# EAGLE design drillholes (EAGLE 7.6.0)

## Sheet 1 of 2
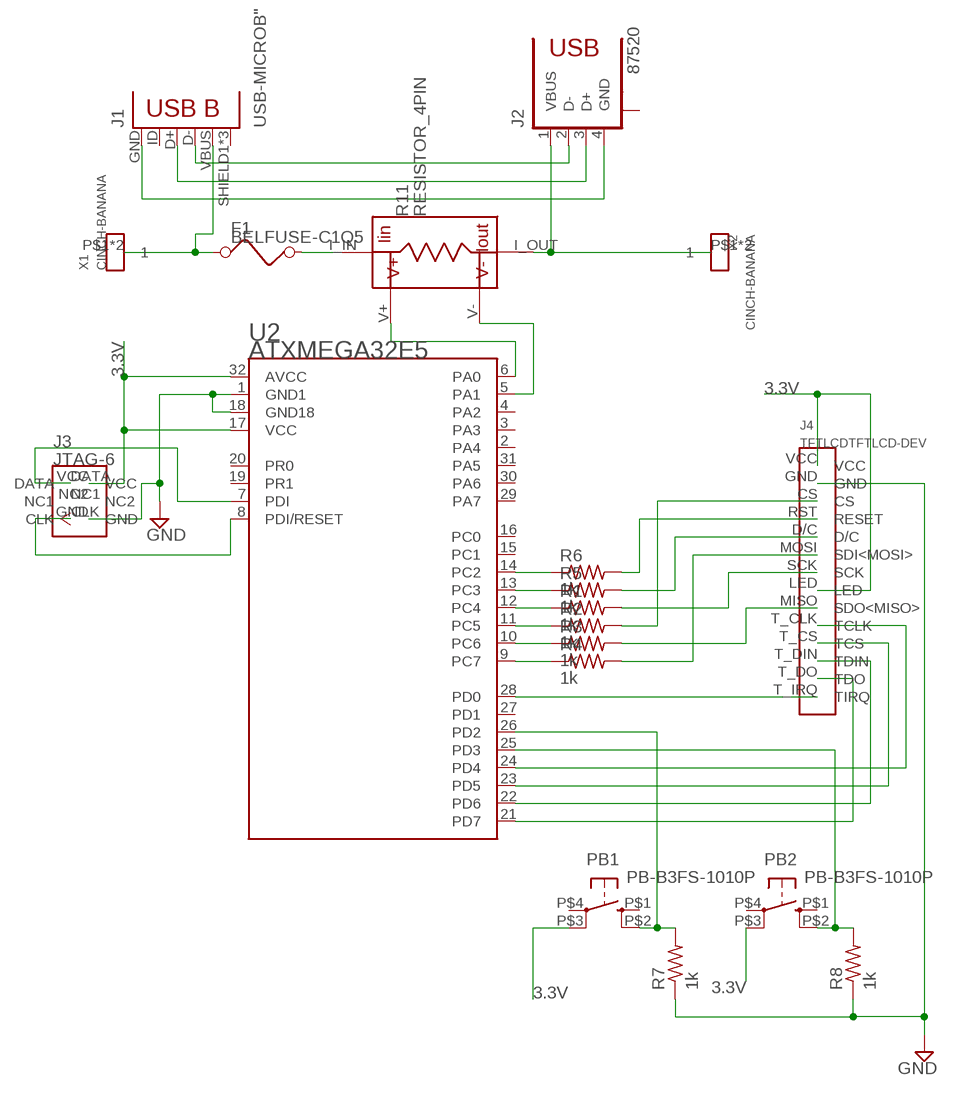
[diagram p0: schematic, sheet 1]

### Parts
ATXMEGA32E5  U2  ATXMEGA32E5/16E5/8E5ATXMEGA32E5-AU  [TQFP32-08]
F1  BELFUSE-C1Q5  [BELFUSE-C1Q5]
J1  USB-MICROB"  [USB-B-MICRO-SMD_V03]
J2  87520  [87520]
J3  JTAG-6  [JTAG6]
J4  TFTLCDTFTLCD-DEV  [TFTLCD]
PB1  PB-B3FS-1010P  [PB-B3FS-1010P]
PB2  PB-B3FS-1010P  [PB-B3FS-1010P]
R1  1k  R-RC1206  [RC1206]
R2  1k  R-RC1206  [RC1206]
R3  1k  R-RC1206  [RC1206]
R4  1k  R-RC1206  [RC1206]
R5  1k  R-RC1206  [RC1206]
R6  1k  R-RC1206  [RC1206]
R7  1k  R-RC1206  [RC1206]
R8  1k  R-RC1206  [RC1206]
R11  RESISTOR_4PIN  [RESISTOR_4PIN]
X1  CINCH-BANANA  [CINCH-BANANA]
X2  CINCH-BANANA  [CINCH-BANANA]

### Nets
3.3V: ATXMEGA32E5.17(VCC) ATXMEGA32E5.32(AVCC) J3.VCC J4.LED J4.VCC PB1.P$3(SW3) PB2.P$3(SW3) ; also sheet 2
GND: ATXMEGA32E5.1(GND1) ATXMEGA32E5.18(GND18) J3.GND J4.GND R7.P$1 R8.P$1 ; also sheet 2
N$1: ATXMEGA32E5.7(PDI) J3.DATA
N$2: ATXMEGA32E5.8(PDI/RESET) J3.CLK
N$3: ATXMEGA32E5.9(PC7) R4.P$1
N$4: ATXMEGA32E5.10(PC6) R3.P$1
N$5: ATXMEGA32E5.11(PC5) R2.P$1
N$6: ATXMEGA32E5.12(PC4) R1.P$1
N$7: J4.MOSI(SDI<MOSI>) R4.P$2
N$8: J4.MISO(SDO<MISO>) R3.P$2
N$9: J4.SCK R1.P$2
N$10: J4.CS R2.P$2
N$11: ATXMEGA32E5.14(PC2) R6.P$1
N$12: J4.RST(RESET) R6.P$2
N$13: ATXMEGA32E5.13(PC3) R5.P$1
N$14: J4.D/C R5.P$2
N$15: ATXMEGA32E5.28(PD0) J4.T_IRQ(TIRQ)
N$16: ATXMEGA32E5.21(PD7) J4.T_DO(TDO)
N$17: ATXMEGA32E5.22(PD6) J4.T_DIN(TDIN)
N$18: ATXMEGA32E5.23(PD5) J4.T_CS(TCS)
N$19: ATXMEGA32E5.24(PD4) J4.T_CLK(TCLK)
N$20: ATXMEGA32E5.26(PD2) PB1.P$2(SW2) R7.P$2
N$21: ATXMEGA32E5.25(PD3) PB2.P$2(SW2) R8.P$2
N$22: ATXMEGA32E5.6(PA0) R11.V+
N$23: ATXMEGA32E5.5(PA1) R11.V-
N$24: F1.P$1 J1.VBUS X1.P$1 X1.P$2
N$25: F1.P$2 R11.I_IN
N$26: J1.GND J2.4(GND)
N$28: J1.D+ J2.3(D+)
N$29: J1.D- J2.2(D-)
N$30: J2.1(VBUS) R11.I_OUT X2.P$1 X2.P$2
Unconnected: ATXMEGA32E5.2(PA4) ATXMEGA32E5.3(PA3) ATXMEGA32E5.4(PA2) ATXMEGA32E5.15(PC1) ATXMEGA32E5.16(PC0) ATXMEGA32E5.19(PR1) ATXMEGA32E5.20(PR0) ATXMEGA32E5.27(PD1) ATXMEGA32E5.29(PA7) ATXMEGA32E5.30(PA6) ATXMEGA32E5.31(PA5) J1.ID(USBID) J1.SHIELD1(SHIELD) J1.SHIELD2(SHIELD) J1.SHIELD3(SHIELD) J2.S1 J2.S2 J3.NC1 J3.NC2 PB1.P$1(SW1) PB1.P$4(SW4) PB2.P$1(SW1) PB2.P$4(SW4)

## Sheet 2 of 2
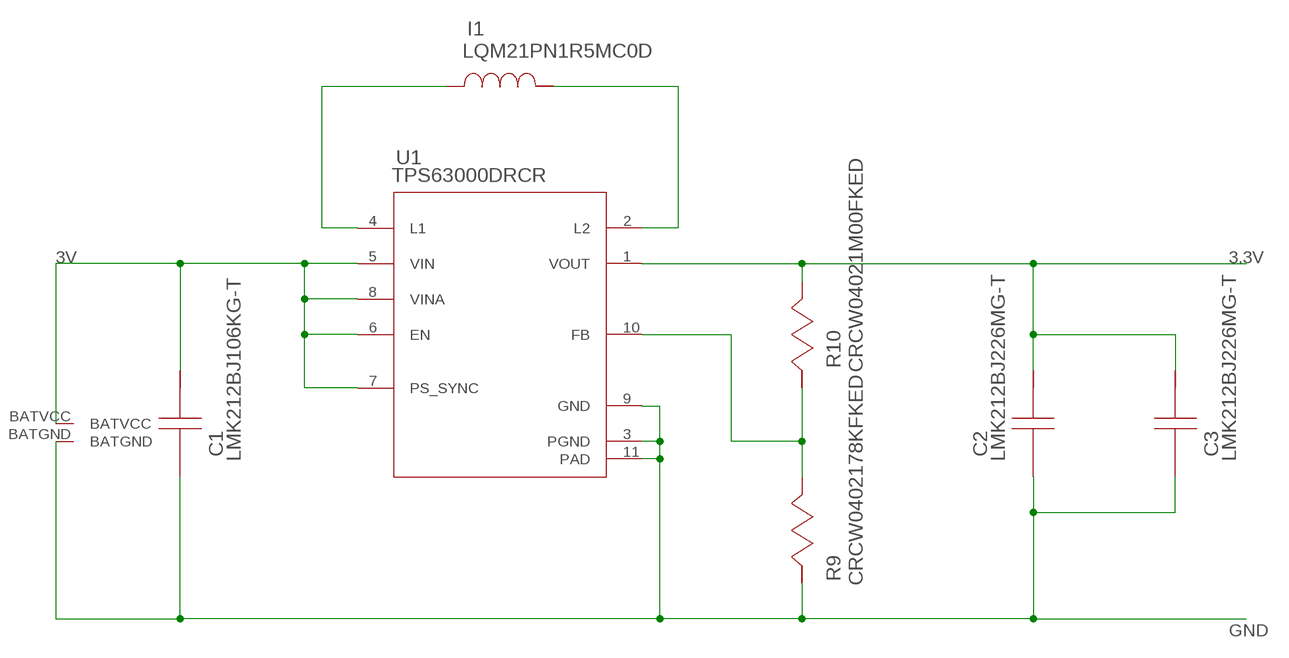
[diagram p1: schematic, sheet 2]

### Parts
C1  LMK212BJ106KG-T  [0805]
C2  LMK212BJ226MG-T  [0805]
C3  LMK212BJ226MG-T  [0805]
I1  LQM21PN1R5MC0D  [0805]
R9  CRCW0402178KFKED  [0402]
R10  CRCW04021M00FKED  [0402]
U1  TPS63000DRCR  [DRC0010J]
U$12  BATTERYHOLDER  [BATTERYHOLDER]

### Nets
3.3V: C2.1 C3.1 R10.1 U1.1(VOUT) ; also sheet 1
3V: C1.1 U1.5(VIN) U1.6(EN) U1.7(PS_SYNC) U1.8(VINA) U$12.BATVCC
GND: C1.2 C2.2 C3.2 R9.2 U1.3(PGND) U1.9(GND) U1.11(PAD) U$12.BATGND ; also sheet 1
N$31: I1.1 U1.4(L1)
N$32: I1.2 U1.2(L2)
N$34: R9.1 R10.2 U1.10(FB)

## Library data of the parts
ATXMEGA32E5 = ese323:ATXMEGA32E5/16E5/8E5: 8/16-bit Atmel AVR XMEGA Microcontrollers
C1 = 00ese323:LMK212BJ106KG-T; MANUFACTURER_NAME: Taiyo Yuden; VENDOR: Taiyo Yuden
C2 C3 = 00ese323:LMK212BJ226MG-T; MANUFACTURER_NAME: Taiyo Yuden; VENDOR: Taiyo Yuden
F1 = 00ese323:BELFUSE-C1Q5
I1 = 00ese323:LQM21PN1R5MC0D; MANUFACTURER_NAME: MuRata; VENDOR: MuRata
J1 = 00ese323:USB-MICROB; PROD_ID: CONN-11752
J2 = 00ese323:87520: TYPE-A Receptacle, FCI
J3 = 00ese323:JTAG-6
J4 = 00ese323:TFTLCD
PB1 PB2 = 00ese323:PB-B3FS-1010P
R1-R8 = 00ese323:R-RC1206
R9 = 00ese323:CRCW0402178KFKED; MANUFACTURER_NAME: Vishay-Dale; VENDOR: Vishay-Dale
R10 = 00ese323:CRCW04021M00FKED; MANUFACTURER_NAME: Vishay-Dale; VENDOR: Vishay-Dale
R11 = 00ese323:RESISTOR_4PIN
U1 = 00ese323:TPS63000DRCR; MANUFACTURER_NAME: Texas Instruments; MANUFACTURER_PART_NUMBER: TPS63000DRCR
U$12 = 00ese323:BATTERYHOLDER
X1 X2 = 00ese323:CINCH-BANANA

## Board
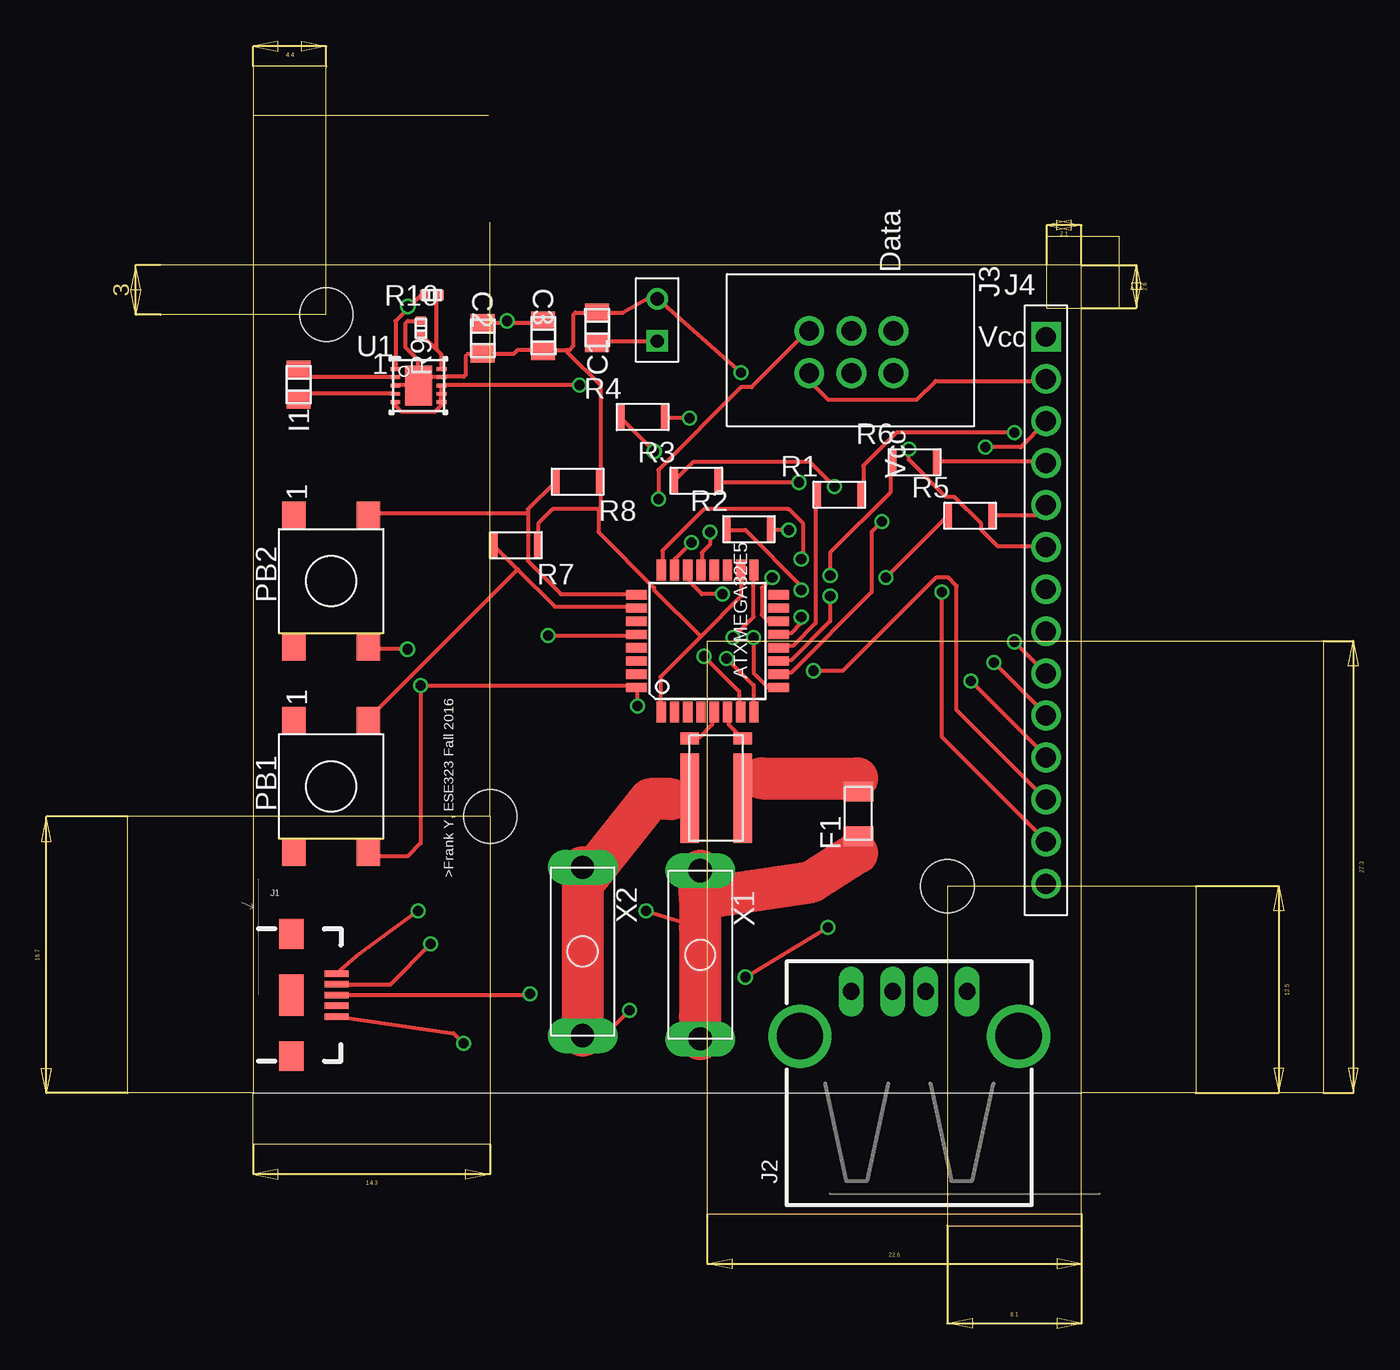
[diagram p2: board, top side]
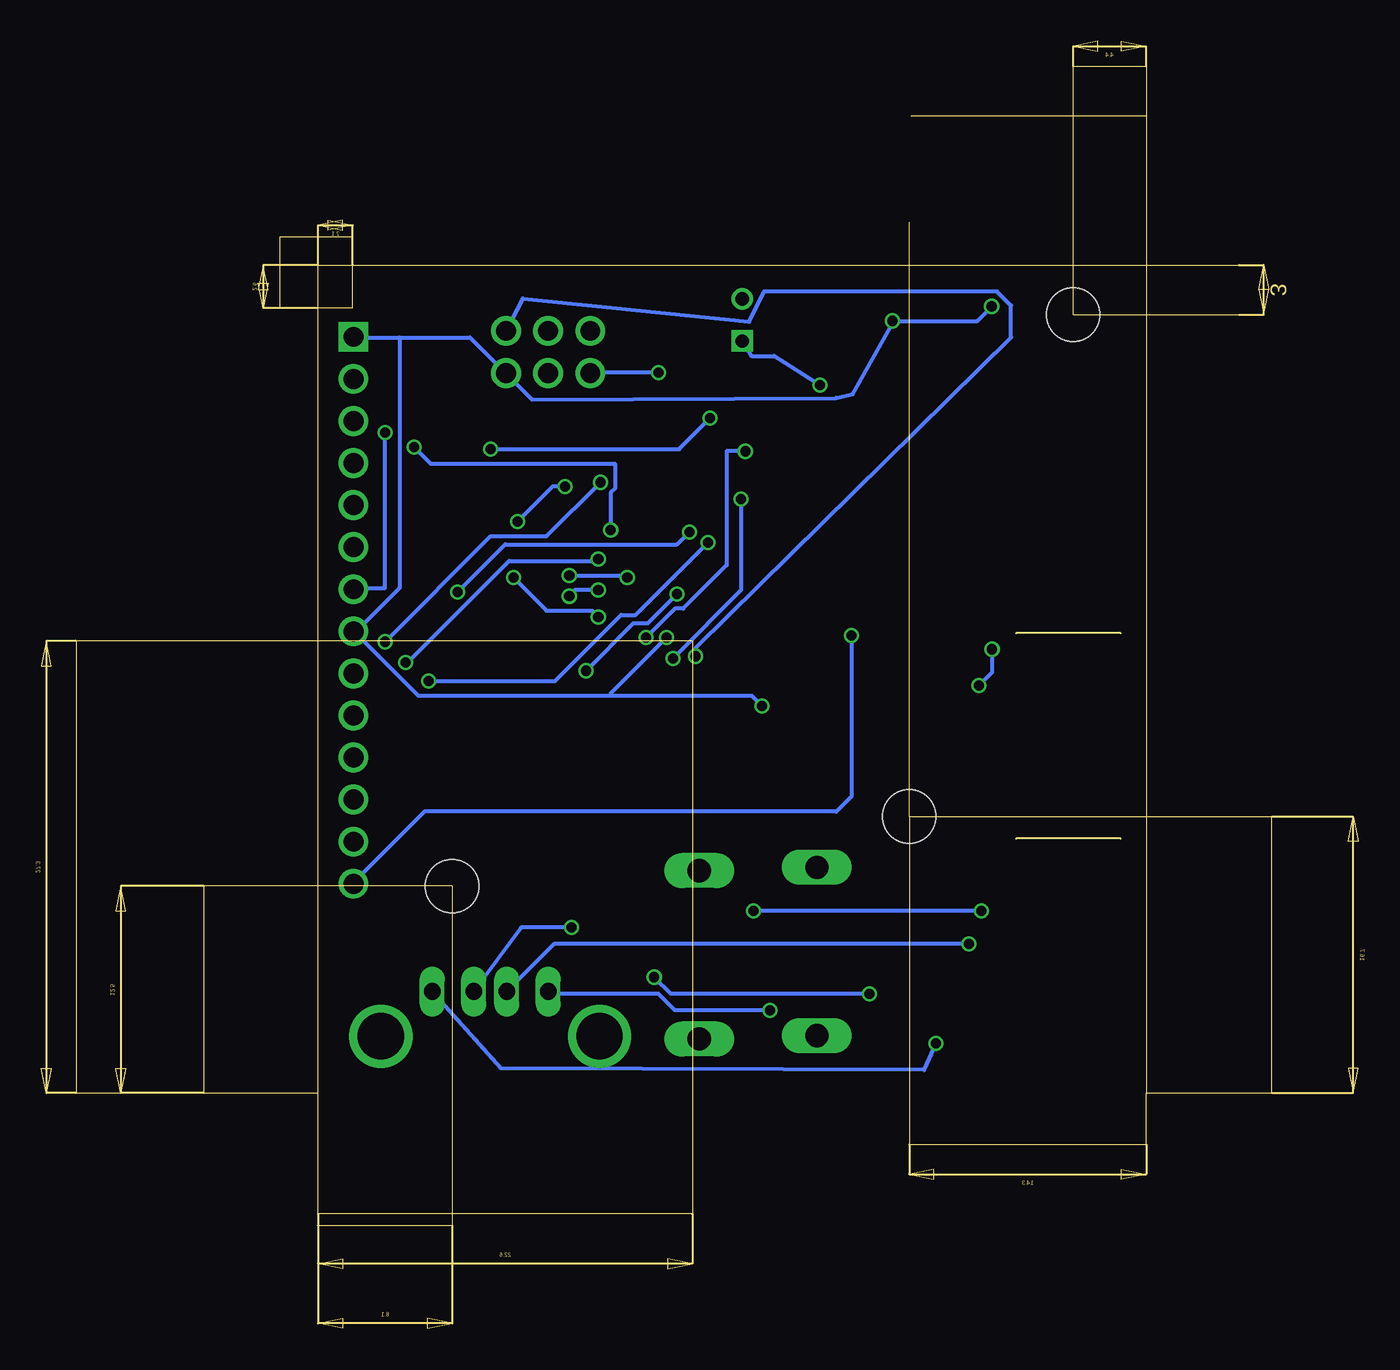
[diagram p3: board, bottom side, seen from below]

Size 72.2 x 70 mm. Coordinates in mm from the lower left corner, seen from the top.
Outline: 57.6,8 57.6,58
Outline: 57.6,58 7.6,58
Outline: 7.6,58 7.6,8
Outline: 7.6,58 2,58
Outline: 2,55 12,55 12,70 7.6,70 7.6,67
Outline: 21.9,24.7 0,24.7 0,8 7.6,8
Outline: 21.8,67 7.6,67
Outline: 7.6,67 7.6,58
Outline: 64.5,8 64.5,20.5 49.5,20.5 49.5,0 57.6,0 57.6,0.7
Outline: 64.5,8 57.6,8
Outline: 57.6,0.7 57.6,8
Outline: 21.9,24.7 21.9,60.6
Outline: 21.9,24.7 21.9,4.9 7.6,4.9 7.6,8
Outline: 64.5,8 72.2,8 72.2,35.3 35,35.3 35,0.7 57.6,0.7
Outline: 57.6,59.7 59.9,59.7 59.9,55.4 55.5,55.4 55.5,59.7 57.6,59.7
Outline: 57.6,58 57.6,59.7
Outline: 57.6,58 60,58
Copper layers (1*16): Top 0.035mm / dielectric 1.5mm / Bottom 0.035mm
Design rules "SeeedStudio_2layer_DRU_no_angle_20140221": minimum track width 6mil, minimum drill 12mil, track to track 6mil, track to pad 6mil, pad to pad 6mil, via to via 6mil, smd to smd 0mil, copper to edge 10mil, drill to drill 10mil, minimum pad ring 10mil, minimum via ring 6mil, stop-mask expansion 2mil, vias tented up to drill 100mil, thermal gap 10mil
Holes 3.2 mm at 12,55 49.5,20.5 21.9,24.7

### Footprints (pad centres in the part's own frame; a part is rotated, then mirrored left to right if it is on the bottom)
TQFP32-08 = smd 1.27 x 0.559: 1 -4.293,2.8; 2 -4.293,2; 3 -4.293,1.2; 4 -4.293,0.4; 5 -4.293,-0.4; 6 -4.293,-1.2; 7 -4.293,-2; 8 -4.293,-2.8; 17 4.293,-2.8; 18 4.293,-2; 19 4.293,-1.2; 20 4.293,-0.4; 21 4.293,0.4; 22 4.293,1.2; 23 4.293,2; 24 4.293,2.8 | smd 0.559 x 1.27: 9 -2.8,-4.293; 10 -2,-4.293; 11 -1.2,-4.293; 12 -0.4,-4.293; 13 0.4,-4.293; 14 1.2,-4.293; 15 2,-4.293; 16 2.8,-4.293; 25 2.8,4.293; 26 2,4.293; 27 1.2,4.293; 28 0.4,4.293; 29 -0.4,4.293; 30 -1.2,4.293; 31 -2,4.293; 32 -2.8,4.293
0805 = smd 1.118 x 1.448: 1 -0.902,0; 2 0.902,0
BELFUSE-C1Q5 = smd 1.2 x 1.8: P$1 0.2,-0.8; P$2 2.9,-0.8
USB-B-MICRO-SMD_V03 = smd 1.45 x 0.4: D+ 2.725,0; D- 2.725,0.65; GND 2.725,-1.3; ID 2.725,-0.65; VBUS 2.725,1.3 | smd 1.5 x 1.8: SHIELD1 0,3.685; SHIELD2 0,-3.685 | smd 1.5 x 2.5: SHIELD3 0,0
87520 = drill 1 long: 1 -3.5,2.71; 2 -1,2.71; 3 1,2.71; 4 3.5,2.71 | drill 2.8: S1 -6.6,0; S2 6.6,0
JTAG6 = drill 1.2: CLK -1.27,-6.14; DATA -1.27,-1.06; GND 1.27,-6.14; NC1 -1.27,-3.6; NC2 1.27,-3.6; VCC 1.27,-1.06
TFTLCD = drill 1.2: CS 0,7.62; D/C 0,2.54; GND 0,10.16; LED 0,-5.08; MISO 0,-7.62; MOSI 0,0; RST 0,5.08; SCK 0,-2.54; T_CLK 0,-10.16; T_CS 0,-12.7; T_DIN 0,-15.24; T_DO 0,-17.78; T_IRQ 0,-20.32 | drill 1.2 square: VCC 0,12.7
PB-B3FS-1010P = smd 1.6 x 1.4: P$1 4,2.25; P$2 4,-2.25; P$3 -4,-2.25; P$4 -4,2.25
RC1206 = smd 0.5 x 1.6: P$1 -1.4,0; P$2 1.3,0
0402 = smd 0.559 x 0.61: 1 -0.419,0; 2 0.419,0
RESISTOR_4PIN = smd 1.1 x 5.4: I_IN 1.6,-0.2; I_OUT -1.6,-0.2 | smd 1.1 x 0.7: V+ 1.6,3.4; V- -1.6,3.4
DRC0010J = smd 0.6 x 0.24: 1 -1.4,1; 2 -1.4,0.5; 3 -1.4,0; 4 -1.4,-0.5; 5 -1.4,-1; 6 1.4,-1; 7 1.4,-0.5; 8 1.4,0; 9 1.4,0.5; 10 1.4,1 | smd 1.65 x 2.4: 11 0,0
BATTERYHOLDER = drill 0.8: BATGND 0,-1.27 | drill 0.8 square: BATVCC 0,1.27
CINCH-BANANA = drill 1.4 long: P$1 -5.08,0; P$2 5.08,0

### Placement (x,y rotation side)
ATXMEGA32E5  35.02,35.29 90 top
C1  28.36,54.21 90 top
C2  21.44,53.57 270 top
C3  25.1,53.73 270 top
F1  43.33,23.3 90 top
I1  10.33,50.78 90 top
J1  9.89,13.92 0 top
J2  47.2,11.43 0 top
J3  47.3,52.75 270 top
J4  55.46,40.96 0 top
PB1  12.29,26.52 90 top
PB2  12.29,38.92 90 top
R1  43.03,44.13 0 top
R2  37.57,42.05 0 top
R3  34.39,44.98 0 top
R4  31.15,48.83 0 top
R5  50.93,42.86 0 top
R6  47.57,46.09 0 top
R7  23.4,41.08 180 top
R8  27.13,44.92 180 top
R9  17.71,54.18 90 top
R10  18.37,56.18 0 top
R11  35.54,26.01 0 top
U1  17.57,50.72 0 top
U$12  31.98,54.68 180 top
X1  34.58,16.35 270 top
X2  27.48,16.55 270 top

### Tracks (layer width: path | path; a pad name or v marks a point on that pad's centre or on a via)
3.3V  (via drill 0.61)
  Top 0.254: v30.8,31.38 30.8,32.38 ATXMEGA32E5.32 30.62,32.6 v17.7,32.6 17.7,23.1 16.9,22.3 14.76,22.3 PB1.P$3 | v36.55,35.5 37.8,36.75 37.8,39.5 ATXMEGA32E5.17 | 16.99,55.44 17.67,56.12 17.92,56.12 R10.1 | 16.99,55.44 16.17,54.62 16.17,51.75 U1.1 | 22.92,54.5 24.92,54.5 25.05,54.62 C3.1 | 22.92,54.5 21.55,54.5 C2.1 | v16.92,55.5 16.99,55.44 | v22.92,54.62 22.92,54.5 | PB2.P$3 14.54,34.84 16.86,34.84 v16.9,34.8
  Bottom 0.254: v30.8,31.38 31.42,32 39.92,32 | 39.92,32 51.55,32 55.42,35.88 J4.LED 55.3,35.88 52.67,38.5 52.67,53.62 | v36.55,35.5 39.92,32.12 39.92,32 | v16.92,55.5 17.8,54.62 v22.92,54.62 22.92,54.5 25.33,50.2 26.33,49.98 44.67,49.88 46.17,51.38 J3.VCC 46.3,51.5 48.42,53.62 52.67,53.62 | 52.67,53.62 55.42,53.62 J4.VCC | v16.9,34.8 16.9,33.4 v17.7,32.6
3V  (via drill 0.61)
  Top 0.254: U1.5 16.17,49.62 16.17,49.5 16.55,49.12 18.55,49.12 19.05,49.62 U1.6 18.92,49.75 18.92,50.12 U1.7 18.92,50.25 18.92,50.62 U1.8 19.05,50.75 v27.3,50.75 | C1.1 28.42,53.38 32,53.38 31.92,53.5 U$12.BATVCC
  Bottom 0.254: v27.3,50.75 30.05,52.5 31.42,52.5 U$12.BATVCC
GND  (via drill 0.61)
  Top 0.254: 34.61,35.56 37.05,38 37.05,39.5 ATXMEGA32E5.18 | 34.61,35.56 32.17,33.12 32.17,31 ATXMEGA32E5.1 | R7.P$1 24.8,42.38 25.67,43.25 28.42,43.25 | 28.42,43.25 28.55,43.38 28.55,44.88 R8.P$1 28.55,45 28.55,50.75 26.55,52.75 26.55,52.88 | U1.3 16.17,50.75 17.42,50.75 17.55,50.88 17.67,50.75 U1.11 | U1.11 17.55,51 17.55,51.25 18.92,51.25 U1.9 19.05,51.25 20.3,51.25 20.42,51.38 20.42,52.5 20.55,52.62 21.42,52.62 C2.2 21.55,52.62 23.3,52.62 23.55,52.88 25.05,52.88 C3.2 25.17,52.88 26.55,52.88 | R9.2 17.67,54.62 16.92,54.62 16.8,54.5 16.8,53 17.55,52.25 17.55,51.38 U1.11 | 26.55,52.88 26.67,52.88 26.92,53.12 26.92,55 27.05,55.12 28.3,55.12 C1.2 28.42,55.12 29.92,55.12 31.3,55.9 31.92,55.9 U$12.BATGND 32.05,55.9 v37.05,51.5 | J4.GND 55.42,51 48.8,51 47.67,49.88 42.3,49.88 41.17,51 41.17,51.38 J3.GND | 34.61,35.56 31.8,38.38 31.8,38.5 28.42,41.88 28.42,43.25
  Bottom 0.254: v37.05,51.5 41.05,51.5 J3.GND
N$1  (via drill 0.61)
  Top 0.254: v34.8,34.38 36.92,32.25 36.92,31 ATXMEGA32E5.7
  Bottom 0.254: v34.8,34.38 34.8,34.88 15.75,53.62 15.75,55.55 16.6,56.4 30.65,56.4 30.67,56.38 31.58,54.58 45.22,55.98 46.17,54.12 J3.DATA
N$2  (via drill 0.61)
  Top 0.254: v36.17,34.25 37.8,32.62 37.8,31 ATXMEGA32E5.8 | v32.05,43.88 32.05,45.62 37.05,50.62 37.67,50.62 41.05,54 J3.CLK
  Bottom 0.254: v36.17,34.25 32.05,38.38 v32.05,43.88
N$3  (via drill 0.61)
  Top 0.254: v37.8,35.5 37.8,33.38 38.67,32.5 ATXMEGA32E5.9 | v31.8,46.75 29.8,48.75 R4.P$1
  Bottom 0.254: v37.8,35.5 36.05,37.25 35.55,37.25 32.92,39.88 32.92,46.75 v31.8,46.75
N$4  (via drill 0.61)
  Top 0.254: v45.55,42.5 44.92,41.88 44.92,38.25 40.05,33.38 39.42,33.38 ATXMEGA32E5.10 | v42.67,44.62 41.17,46.12 34.17,46.12 33.05,45 R3.P$1
  Bottom 0.254: v45.55,42.5 43.42,44.62 v42.67,44.62
N$5  (via drill 0.61)
  Top 0.254: v42.42,38 42.42,36.5 40.05,34.12 39.42,34.12 ATXMEGA32E5.11 | v40.67,38.38 40.67,38.62 37.3,42 36.17,42 R2.P$1
  Bottom 0.254: v42.42,38 42.05,38.38 v40.67,38.38
N$6
  Top 0.254: ATXMEGA32E5.12 39.42,35 40.17,35 41.55,36.38 41.55,44.12 R1.P$1
N$7  (via drill 0.61)
  Top 0.254: v33.92,48.75 32.55,48.75 R4.P$2 | v47.17,46.88 47.17,46.25 49.42,44 49.92,44 51.55,42.38 51.55,42 52.55,41 55.42,41 J4.MOSI
  Bottom 0.254: v33.92,48.75 35.8,46.88 v47.17,46.88
N$8  (via drill 0.61)
  Top 0.254: v40.55,44.88 35.8,44.88 R3.P$2 | J4.MISO v53.55,35.25
  Bottom 0.254: v40.55,44.88 43.8,41.62 47.17,41.62 v53.55,35.25
N$9  (via drill 0.61)
  Top 0.254: v53.55,47.88 46.42,47.88 44.42,45.88 44.42,44.25 R1.P$2
  Bottom 0.254: v53.55,47.88 53.55,38.5 55.42,38.5 J4.SCK
N$10  (via drill 0.61)
  Top 0.254: v39.92,42 38.92,42 R2.P$2 | v51.8,47 53.92,47 55.42,48.5 J4.CS
  Bottom 0.254: v39.92,42 39.92,44.25 39.67,44.5 39.67,46 50.8,46 v51.8,47
N$11  (via drill 0.61)
  Top 0.254: v38.92,39.12 38.3,38.5 38.3,36.88 38.67,36.5 ATXMEGA32E5.14 | v42.42,39.25 42.42,40.62 46.05,44.25 46.05,46 R6.P$1
  Bottom 0.254: v38.92,39.12 39.05,39.25 v42.42,39.25
N$12
  Top 0.254: R6.P$2 48.92,46.12 55.42,46.12 J4.RST
N$13  (via drill 0.61)
  Top 0.254: v40.67,36.75 40.67,36.38 40.05,35.75 39.42,35.75 ATXMEGA32E5.13 | v45.8,39.12 49.42,42.75 R5.P$1
  Bottom 0.254: v40.67,36.75 41.05,37.12 43.8,37.12 v45.8,39.12
N$14
  Top 0.254: R5.P$2 52.3,42.88 54.8,42.88 55.42,43.5 J4.D/C
N$15  (via drill 0.61)
  Top 0.254: v25.4,35.62 30.67,35.62 ATXMEGA32E5.28
  Bottom 0.254: J4.T_IRQ 55.42,20.75 51.17,25 26.3,25 25.4,25.9 v25.4,35.62
N$16  (via drill 0.61)
  Top 0.254: v35.17,41.88 35.17,41.12 34.67,40.62 34.67,39.62 ATXMEGA32E5.21 | v49.17,38.25 49.17,29.5 55.42,23.25 J4.T_DO
  Bottom 0.254: v35.17,41.88 35.92,41.12 46.3,41.12 v49.17,38.25
N$17  (via drill 0.61)
  Top 0.254: v35.92,38.12 34.67,38.12 33.92,38.88 33.92,39.5 ATXMEGA32E5.22 | v41.42,33.5 43.17,33.5 48.8,39.12 49.55,39.12 50.05,38.62 50.05,31.12 55.42,25.75 J4.T_DIN
  Bottom 0.254: v35.92,38.12 37.67,36.38 38.55,36.38 v41.42,33.5
N$18  (via drill 0.61)
  Top 0.254: v34.05,41.25 33.05,40.25 33.05,39.62 ATXMEGA32E5.23 | v50.92,32.88 55.42,28.38 J4.T_CS
  Bottom 0.254: v34.05,41.25 38.42,36.88 39.3,36.88 43.3,32.88 v50.92,32.88
N$19  (via drill 0.61)
  Top 0.254: v40.67,40.25 40.8,40.38 40.8,42.38 39.92,43.25 34.8,43.25 32.3,40.75 32.3,39.62 ATXMEGA32E5.24 | v52.3,34 55.42,30.88 J4.T_CLK
  Bottom 0.254: v40.67,40.25 40.8,40.12 46.05,40.12 52.17,34 v52.3,34
N$20
  Top 0.254: 23.55,39.62 22.17,41 R7.P$2 | 23.55,39.62 25.8,37.38 30.67,37.38 ATXMEGA32E5.26 | 23.55,39.62 14.55,30.62 PB1.P$2
N$21
  Top 0.254: 24.17,43 24.17,43.25 25.8,44.88 R8.P$2 | 24.17,43 24.17,40.12 26.17,38.12 30.67,38.12 ATXMEGA32E5.25 | 24.17,43 14.55,43 PB2.P$2
N$22
  Top 0.254: R11.V+ 36.3,30.25 36.3,30.88 ATXMEGA32E5.6
N$23
  Top 0.254: R11.V- 34.05,29.5 34.55,29.5 35.3,30.25 35.3,30.88 ATXMEGA32E5.5
N$24  (via drill 0.61)
  Top 0.254: v17.55,19 13.8,16.25 J1.VBUS | 44.05,22.5 F1.P$1 | v31.3,19 34.55,18
  Top 2.54: 44.05,22.5 41.3,20.75 34.55,19.75 | 34.55,19.75 34.55,18 34.55,12.64 X1.P$2 | 34.55,19.75 34.5,20.75 X1.P$1
  Bottom 0.254: v17.55,19 v31.3,19
N$25
  Top 0.254: 37.05,25.88 R11.I_IN 38.3,27 | 44.05,27 F1.P$2
  Top 2.54: 38.3,27 44.05,27
N$26  (via drill 0.61)
  Top 0.254: J1.GND 19.68,11.62 v20.3,11
  Bottom 0.254: J2.4 46.56,9.5 21,9.4 v20.3,11
N$28  (via drill 0.61)
  Top 0.254: v37.3,15 v42.3,18 | J1.D+ 24.22,13.92 v24.3,14
  Bottom 0.254: v24.3,14 36.3,14 v37.3,15 | v42.3,18 45.34,18 J2.3
N$29  (via drill 0.61)
  Top 0.254: J1.D- 15.87,14.57 v18.3,17
  Bottom 0.254: v18.3,17 43.34,17 J2.2
N$30  (via drill 0.61)
  Top 0.254: 27.55,20.75 X2.P$1 | 32.8,25.75 R11.I_OUT | X2.P$2 27.77,10.47 v30.3,13
  Top 2.54: 27.55,20.75 31.55,25.75 32.8,25.75 | X2.P$1 X2.P$2
  Bottom 0.254: J2.1 43.55,14 37.05,14 36.05,13 v30.3,13
N$31
  Top 0.254: U1.4 16.05,50.25 10.67,50.25 10.42,50 I1.1
N$32
  Top 0.254: U1.2 16.05,51.25 10.8,51.25 10.42,51.62 I1.2
N$34
  Top 0.254: 18.61,52.94 17.8,53.75 R9.1 | 18.61,52.94 18.92,52.62 18.92,51.75 U1.10 | R10.2 18.67,56.12 18.67,53 18.61,52.94

### Text on the board
tPlace: >Frank Y, ESE323 Fall 2016